# Altium schematic sheet USB-Hub.SchDoc: USB HUB
size A4; Revision: 1.0; SheetNumber: 2
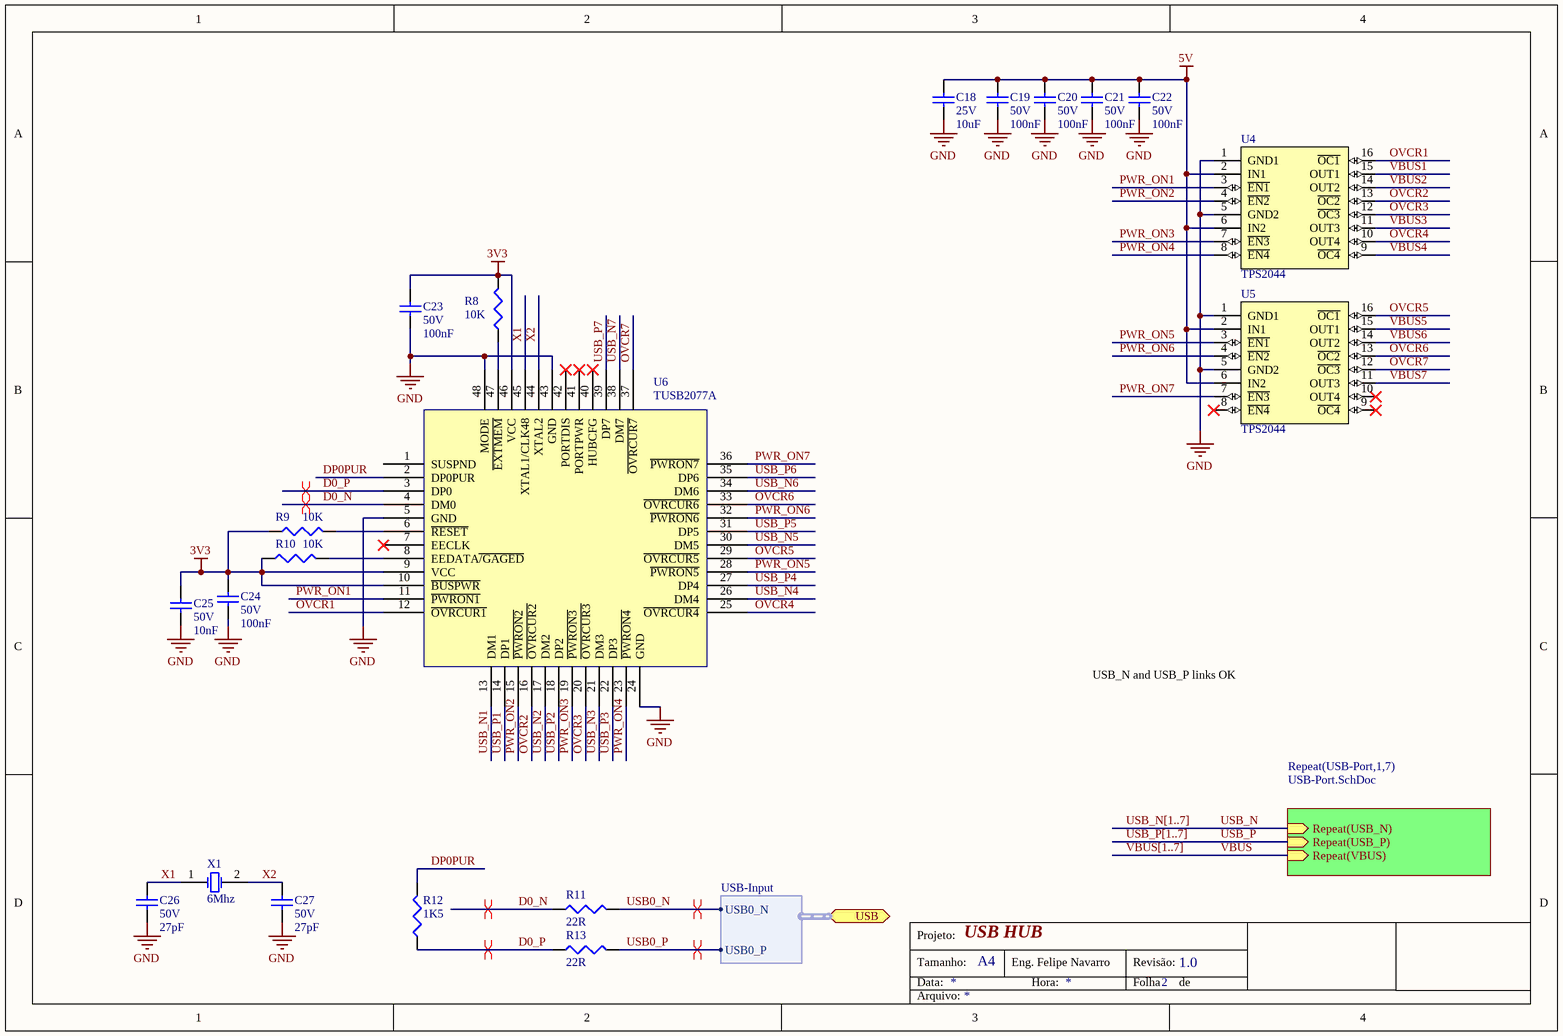
[diagram p0: USB-Hub.SchDoc]

## Parts
C18  value 10uF  Tensão: 25V  [CC0805]  (hidden comment: Capacitor Cerâmico)
C19  value 100nF  Tensão: 50V  [CC0603]  (hidden comment: Capacitor Cerâmico)
C20  value 100nF  Tensão: 50V  [CC0603]  (hidden comment: Capacitor Cerâmico)
C21  value 100nF  Tensão: 50V  [CC0603]  (hidden comment: Capacitor Cerâmico)
C22  value 100nF  Tensão: 50V  [CC0603]  (hidden comment: Capacitor Cerâmico)
C23  value 100nF  Tensão: 50V  [CC0603]  (hidden comment: Capacitor Cerâmico)
C24  value 100nF  Tensão: 50V  [CC0603]  (hidden comment: Capacitor Cerâmico)
C25  value 10nF  Tensão: 50V  [CC0603]  (hidden comment: Capacitor Cerâmico)
C26  value 27pF  Tensão: 50V  [CC0603]  (hidden comment: Capacitor Cerâmico)
C27  value 27pF  Tensão: 50V  [CC0603]  (hidden comment: Capacitor Cerâmico)
R8  value 10K  [CC0603]  (hidden comment: Resistor)
R9  value 10K  [CC0603]  (hidden comment: Resistor)
R10  value 10K  [CC0603]  (hidden comment: Resistor)
R11  value 22R  [CC0603]  (hidden comment: Resistor)
R12  value 1K5  [CC0603]  (hidden comment: Resistor)
R13  value 22R  [CC0603]  (hidden comment: Resistor)
U4  TPS2044  [SOIC-16N]
U5  TPS2044  [SOIC-16N]
U6  TUSB2077A  [TQFP-48N]
X1  6Mhz  [HC/49US]

## Sub-sheets
Repeat(USB-Port,1,7) = USB-Port.SchDoc: Repeat(USB_N) (in), Repeat(USB_P) (in), Repeat(VBUS) (in)

## Ports
USB (harness USB-Input)

## Harnesses
USB-Input: USB0_N, USB0_P

## Nets
3V3: C23.2 C24.2 C25.2 R8.2 R9.1 R10.1 U6.9(VCC) U6.10(~{BUSPWR}) U6.46(VCC)
5V: C18.2 C19.2 C20.2 C21.2 C22.2 U4.2(IN1) U4.6(IN2) U5.2(IN1) U5.6(IN2)
GND: C18.1 C19.1 C20.1 C21.1 C22.1 C23.1 C24.1 C25.1 C26.1 C27.1 U4.1(GND1) U4.5(GND2) U5.1(GND1) U5.5(GND2) U6.5(GND) U6.24(GND) U6.43(GND) U6.48(MODE)
D0_N: R11.1 U6.4(DM0)
D0_P: R12.1 R13.1 U6.3(DP0)
DP0PUR: R12.2 U6.2(DP0PUR)
OVCR1: U4.16(~{OC1}) U6.12(~{OVRCUR1})
OVCR2: U4.13(~{OC2}) U6.16(~{OVRCUR2})
OVCR3: U4.12(~{OC3}) U6.20(~{OVRCUR3})
OVCR4: U4.10(OUT4) U6.25(~{OVRCUR4})
OVCR5: U5.16(~{OC1}) U6.29(~{OVRCUR5})
OVCR6: U5.13(~{OC2}) U6.33(~{OVRCUR6})
OVCR7: U5.12(~{OC3}) U6.37(~{OVRCUR7})
PWR_ON1: U4.3(~{EN1}) U6.11(~{PWRON1})
PWR_ON2: U4.4(~{EN2}) U6.15(~{PWRON2})
PWR_ON3: U4.7(~{EN3}) U6.19(~{PWRON3})
PWR_ON4: U4.8(~{EN4}) U6.23(~{PWRON4})
PWR_ON5: U5.3(~{EN1}) U6.28(~{PWRON5})
PWR_ON6: U5.4(~{EN2}) U6.32(~{PWRON6})
PWR_ON7: U5.7(~{EN3}) U6.36(~{PWRON7})
USB0_N: R11.2 ; port USB.USB0_N
USB0_P: R13.2 ; port USB.USB0_P
USB_N: sheet Repeat(USB-Port,1,7)/Repeat(USB_N)
USB_N1: U6.13(DM1)
USB_N2: U6.17(DM2)
USB_N3: U6.21(DM3)
USB_N4: U6.26(DM4)
USB_N5: U6.30(DM5)
USB_N6: U6.34(DM6)
USB_N7: U6.38(DM7)
USB_P: sheet Repeat(USB-Port,1,7)/Repeat(USB_P)
USB_P1: U6.14(DP1)
USB_P2: U6.18(DP2)
USB_P3: U6.22(DP3)
USB_P4: U6.27(DP4)
USB_P5: U6.31(DP5)
USB_P6: U6.35(DP6)
USB_P7: U6.39(DP7)
VBUS: sheet Repeat(USB-Port,1,7)/Repeat(VBUS)
VBUS1: U4.15(OUT1)
VBUS2: U4.14(OUT2)
VBUS3: U4.11(OUT3)
VBUS4: U4.9(~{OC4})
VBUS5: U5.15(OUT1)
VBUS6: U5.14(OUT2)
VBUS7: U5.11(OUT3)
X1: C26.2 U6.45(XTAL1/CLK48) X1.1(OSC1)
X2: C27.2 U6.44(XTAL2) X1.2(OSC2)
NetR8_1: R8.1 U6.47(~{EXTMEM})
NetR9_2: R9.2 U6.6(~{RESET})
NetR10_2: R10.2 U6.8(EEDATA~{/GAGED})

Not connected (* = marked no-connect by the designer): U5 8(~{EN4})* 9(~{OC4})* 10(OUT4)*; U6 1(SUSPND) 7(EECLK)* 40(HUBCFG)* 41(PORTPWR)* 42(PORTDIS)*

## Buses and harness runs
bus USB_N[1..7]
bus USB_P[1..7]
bus VBUS[1..7]

## Layout directives
differential pair: D0_N, D0_P, USB0_N, USB0_P

## Notes on the sheet
- USB_N and USB_P links OK
- Projeto:
- Tamanho:
- Data:
- A4
- Eng. Felipe Navarro
- Hora:
- Revisão:
- Folha
- de
- Arquivo:

## Library data of the parts
C18 = Cap 10uF 25V 0805 X5R: Capacitor (Semiconductor SIM Model); Chinês: Local; ChinesePrice: 0,02620; Corrente: *A; Potência: *W; Obs:: X5R; Tolerância: ±10%; Supplier 1: Digi-Key; Supplier Part Number 1: 587-2985-1-ND; ComponentLink1Description: Datasheet; ComponentLink1URL: D:\Tecnoclade\Datasheet\!DataMissing.pdf
C19-C24 = Cap 100nF 50V 0603 X7R: Capacitor (Semiconductor SIM Model); Chinês: Local; ChinesePrice: 0,00250; Corrente: *A; Potência: *W; Obs:: X7R; Tolerância: ±10%; Supplier 1: Digi-Key; Supplier Part Number 1: 1276-1000-1-ND; ComponentLink1Description: Datasheet; ComponentLink1URL: D:\Tecnoclade\Datasheet\!DataMissing.pdf
C25 = Cap 10nF 50V 0603 X7R 5%: Capacitor (Semiconductor SIM Model); Chinês: Local; ChinesePrice: 0,00320; Corrente: *A; Potência: *W; Obs:: X7R; Tolerância: ±5%; Supplier 1: Digi-Key; Supplier Part Number 1: 399-1092-1-ND; ComponentLink1Description: Datasheet; ComponentLink1URL: D:\Tecnoclade\Datasheet\!DataMissing.pdf
C26 C27 = Cap 27pF 50V 0603 NP0: Capacitor (Semiconductor SIM Model); Chinês: -----; ChinesePrice: 0,00000; Corrente: *A; Potência: *W; Obs:: NP0; Tolerância: ±5%; Supplier 1: Digi-Key; Supplier Part Number 1: 445-1274-1-ND; ComponentLink1Description: Datasheet; ComponentLink1URL: D:\Tecnoclade\Datasheet\!DataMissing.pdf
R8-R10 = Res 10K 1% 0603 1/10W: ChinesePrice: 0,00089; Chinês: Local; Corrente: *A; Potência: 1/10W; Tensão: *V; Tolerância: ±1%; Supplier 1: Digi-Key; Supplier Part Number 1: P10.0KHCT-ND; Obs: *; ComponentLink1Description: Datasheet; ComponentLink1URL: D:\Tecnoclade\Datasheet\!DataMissing.pdf
R11 R13 = Res 22R 1% 0603 1/10W: ChinesePrice: 0,00000; Chinês: ----; Corrente: *A; Potência: 1/10W; Tensão: *V; Obs: ±100ppm/ºC; Tolerância: ±1%; Supplier 1: Digi-Key; Supplier Part Number 1: RMCF0603FT22R0CT-ND; ComponentLink1Description: Datasheet; ComponentLink1URL: D:\Tecnoclade\Datasheet\!DataMissing.pdf
R12 = Res 1K5 1% 0603 1/10W: ChinesePrice: 0,00000; Chinês: ----; Corrente: *A; Potência: 1/10W; Tensão: *V; Obs: ±100ppm/ºC; Tolerância: ±1%; Supplier 1: Digi-Key; Supplier Part Number 1: 311-1.50KHRCT-ND; ComponentLink1Description: Datasheet; ComponentLink1URL: D:\Tecnoclade\Datasheet\!DataMissing.pdf
U4 U5 = TPS2044: QUAD POWER-DISTRIBUTION SWITCH; ChinesePrice: 0,00000; Chinês: ----; Tensão: 2V3 ~ 5V5; Corrente: *; Potência: *; Value: *; Supplier 1: Digi-Key; Supplier Part Number 1: 296-18931-5-ND; Obs:: *; Tolerância: *; ComponentLink1Description: *; ComponentLink1URL: *; ComponentLink2URL: *; ComponentLink2Description: *
U6 = TUSB2077A: USB HUB 7 Port; ChinesePrice: 0,00000; Chinês: ----; Corrente: *; Potência: *; Supplier 1: Digi-Key; Supplier Part Number 1: 296-37871-1-ND; Tensão: *; Obs:: *; Tolerância: *; ComponentLink1Description: Datasheet; ComponentLink1URL: *
X1 = XTAL: Crystal Oscillator; ChinesePrice: 0,00000; Chinês: ----; Value: 20pF/40R; Corrente: *; Potência: *; Supplier 1: Digi-Key; Supplier Part Number 1: --Del; Tensão: *; Obs:: *; Tolerância: *